# Altium schematic sheet STM32H743VIT6.SchDoc
size A4; SheetNumber: 1; SheetTotal: 2
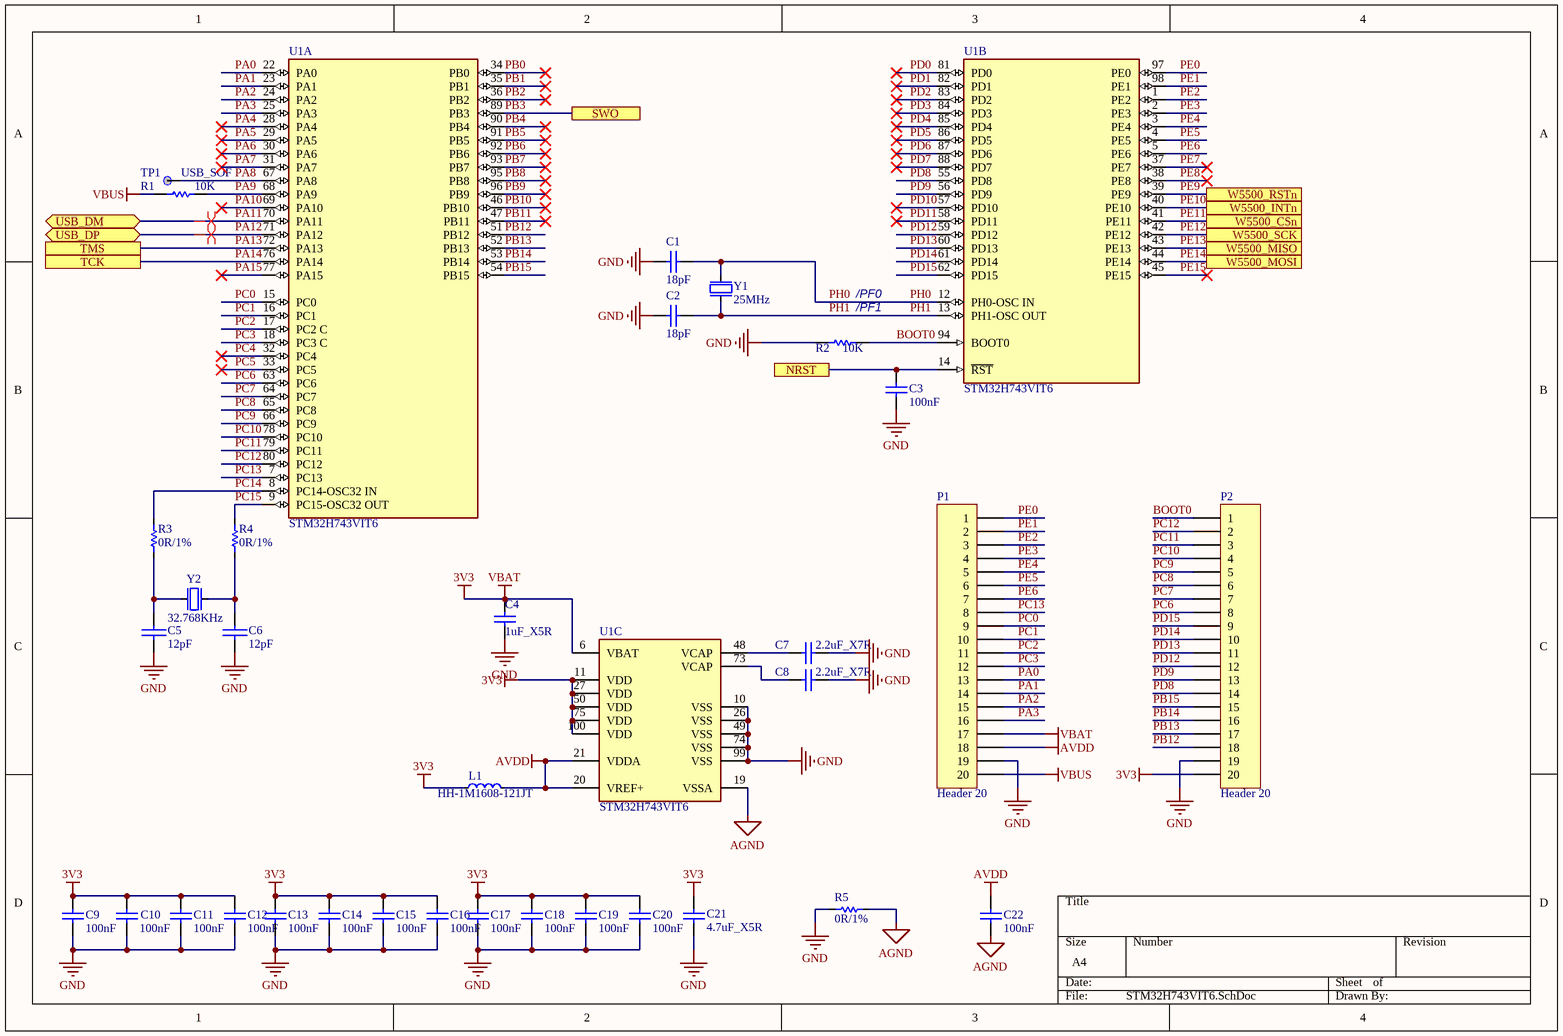
[diagram p0: STM32H743VIT6.SchDoc]

## Parts
C1  18pF  [CAP-0402]
C2  18pF  [CAP-0402]
C3  100nF  [CAP-0402]
C4  1uF_X5R  [CAP-0402]
C5  12pF  [CAP-0402]
C6  12pF  [CAP-0402]
C7  2.2uF_X7R  [CAP-0402]
C8  2.2uF_X7R  [CAP-0402]
C9  100nF  [CAP-0402]
C10  100nF  [CAP-0402]
C11  100nF  [CAP-0402]
C12  100nF  [CAP-0402]
C13  100nF  [CAP-0402]
C14  100nF  [CAP-0402]
C15  100nF  [CAP-0402]
C16  100nF  [CAP-0402]
C17  100nF  [CAP-0402]
C18  100nF  [CAP-0402]
C19  100nF  [CAP-0402]
C20  100nF  [CAP-0402]
C21  4.7uF_X5R  [CAP-0402]
C22  100nF  [CAP-0402]
L1  HH-1M1608-121JT  [IND-0603]
P1  Header 20  [IDC-1X20]
P2  Header 20  [IDC-1X20]
R1  10K  [RES-0402]
R2  10K  [RES-0402]
R3  0R/1%  [RES-0402]
R4  0R/1%  [RES-0402]
R5  0R/1%  [RES-0402]
TP1  USB_SOF  [TP]
U1  STM32H743VIT6  [FP-LQFP100-1L-MFG]  (parts A,B,C of 3)
Y1  25MHz  [OSC-S3225A]
Y2  32.768KHz  [OSC-S3225A]

## Ports
NRST, SWO, TCK, TMS, USB_DM (bidir), USB_DP (bidir), W5500_CSn, W5500_INTn, W5500_MISO, W5500_MOSI, W5500_RSTn, W5500_SCK

## Nets
3V3: C4.2 C9.1 C10.1 C11.1 C12.1 C13.1 C14.1 C15.1 C16.1 C17.1 C18.1 C19.1 C20.1 C21.1 L1.1 P1.17 P2.20 U1.6(VBAT) U1.11(VDD) U1.27(VDD) U1.50(VDD) U1.75(VDD) U1.100(VDD)  [also labelled VBAT]
AGND: C22.2 R5.1 U1.19(VSSA)
AVDD: C22.1 L1.2 P1.18 U1.20(VREF+) U1.21(VDDA)
GND: C1.1 C2.1 C3.2 C4.1 C5.2 C6.2 C7.2 C8.2 C9.2 C10.2 C11.2 C12.2 C13.2 C14.2 C15.2 C16.2 C17.2 C18.2 C19.2 C20.2 C21.2 P1.19 P2.19 R2.1 R5.2 U1.10(VSS) U1.26(VSS) U1.49(VSS) U1.74(VSS) U1.99(VSS) Y1.2(GND) Y1.4(GND) Y2.2(GND) Y2.4(GND)
VBUS: P1.20 R1.1
BOOT0: P2.1 R2.2 U1.94(BOOT0)
NRST: C3.1 U1.14(~{RST}) ; port NRST
PA0: P1.13 U1.22(PA0)
PA1: P1.14 U1.23(PA1)
PA2: P1.15 U1.24(PA2)
PA3: P1.16 U1.25(PA3)
PA4: U1.28(PA4)
PA5: U1.29(PA5)
PA6: U1.30(PA6)
PA7: U1.31(PA7)
PA8: TP1.1 U1.67(PA8)
PA9: R1.2 U1.68(PA9)
PA10: U1.69(PA10)
PA11: U1.70(PA11) ; port USB_DM
PA12: U1.71(PA12) ; port USB_DP
PA13: U1.72(PA13) ; port TMS
PA14: U1.76(PA14) ; port TCK
PA15: U1.77(PA15)
PB0: U1.34(PB0)
PB1: U1.35(PB1)
PB2: U1.36(PB2)
PB3: U1.89(PB3) ; port SWO
PB4: U1.90(PB4)
PB5: U1.91(PB5)
PB6: U1.92(PB6)
PB7: U1.93(PB7)
PB8: U1.95(PB8)
PB9: U1.96(PB9)
PB10: U1.46(PB10)
PB11: U1.47(PB11)
PB12: P2.18 U1.51(PB12)
PB13: P2.17 U1.52(PB13)
PB14: P2.16 U1.53(PB14)
PB15: P2.15 U1.54(PB15)
PC0: P1.9 U1.15(PC0)
PC1: P1.10 U1.16(PC1)
PC2: P1.11 U1.17(PC2_C)
PC3: P1.12 U1.18(PC3_C)
PC4: U1.32(PC4)
PC5: U1.33(PC5)
PC6: P2.8 U1.63(PC6)
PC7: P2.7 U1.64(PC7)
PC8: P2.6 U1.65(PC8)
PC9: P2.5 U1.66(PC9)
PC10: P2.4 U1.78(PC10)
PC11: P2.3 U1.79(PC11)
PC12: P2.2 U1.80(PC12)
PC13: P1.8 U1.7(PC13)
PC14: R3.2 U1.8(PC14-OSC32_IN)
PC15: R4.2 U1.9(PC15-OSC32_OUT)
PD0: U1.81(PD0)
PD1: U1.82(PD1)
PD2: U1.83(PD2)
PD3: U1.84(PD3)
PD4: U1.85(PD4)
PD5: U1.86(PD5)
PD6: U1.87(PD6)
PD7: U1.88(PD7)
PD8: P2.14 U1.55(PD8)
PD9: P2.13 U1.56(PD9)
PD10: U1.57(PD10)
PD11: U1.58(PD11)
PD12: P2.12 U1.59(PD12)
PD13: P2.11 U1.60(PD13)
PD14: P2.10 U1.61(PD14)
PD15: P2.9 U1.62(PD15)
PE0: P1.1 U1.97(PE0)
PE1: P1.2 U1.98(PE1)
PE2: P1.3 U1.1(PE2)
PE3: P1.4 U1.2(PE3)
PE4: P1.5 U1.3(PE4)
PE5: P1.6 U1.4(PE5)
PE6: P1.7 U1.5(PE6)
PE7: U1.37(PE7)
PE8: U1.38(PE8)
PE9: U1.39(PE9) ; port W5500_RSTn
PE10: U1.40(PE10) ; port W5500_INTn
PE11: U1.41(PE11) ; port W5500_CSn
PE12: U1.42(PE12) ; port W5500_SCK
PE13: U1.43(PE13) ; port W5500_MISO
PE14: U1.44(PE14) ; port W5500_MOSI
PE15: U1.45(PE15)
PH0: C1.2 U1.12(PH0-OSC_IN) Y1.1(inp)
PH1: C2.2 U1.13(PH1-OSC_OUT) Y1.3(out)
NetC5_1: C5.1 R3.1 Y2.1(inp)
NetC6_1: C6.1 R4.1 Y2.3(out)
NetC7_1: C7.1 U1.48(VCAP)
NetC8_1: C8.1 U1.73(VCAP)

## Layout directives
differential pair: PA11, PA12

## Notes on the sheet
- (near R2) /PF0
- (near R2) /PF1

## Library data of the parts
C1 C2 C4 = CAP-0402: Ceramic CAP 0402(1005)
C3 C9-C20 C22 = Cap: 0402; Value: 10nF; Published: 8-Jun-2000; Revision: July-2002: Re-released for DXP Platform.; Publisher: Altium Limited
C5 C6 = CAP: 0402
C7 C8 = Cap_2.2uF_X7R_10%_0805: 0402 X5R; Manuf_Part_1: CC0805KKX7R7BB225; Manuf_1: YAGEO; Value: 2.2uF; Revision: July-2002: Re-released for DXP Platform.; Order: CC0805KKX7R7BB225
C21 = CAP SMD 0603  X5R 1킚 25V 10%: 0402  X5R 4.7uF; Value: 1킚; Rated voltage: 25V; Tolerance: 10%; Manufacturer: *; Manufacturer P/N: *; Order code Farnell: 1288202RL; Power: *; Technology: X5R; Temperature  Factor: *; Temperature Max: +125캜; Temperature Min: -55캜; STS Code: *
L1 = IND-0603: Inductor 0603(1608)
P1 P2 = Header 20: Header, 20-Pin; LatestRevisionDate: 17-Jul-2002; LatestRevisionNote: Re-released for DXP Platform.; Publisher: Altium Limited
R1 = Resistor_ST: 0402; Value: 10K
R2 = res1: Resistor; Value: 1K; Published: 8-Jun-2000; Revision: July-2002: Re-released for DXP Platform.; Publisher: Altium Limited
R3-R5 = RES-0402
TP1 = TP
U1 = CMP-12105-000050-1: IC MCU 32BIT 2MB FLASH 100LQFP; Manufacturer: STMicroelectronics; Number Of Ethernet Channels: 1; Number Of Usb Channels: 2; Number Of A/D Converters: 3; Min Supply Voltage: 1.71V; Ram Size: 1060KBytes; Number Of I2C Channels: 4; Frequency: 480MHz; Number Of Adc Channels: 36; Number Of I/Os: 82; Max Supply Voltage: 3.6V; Number Of Spi Channels: 6; Memory Size: 2MBytes; Max Junction Temp: +125°C; Core Architecture: Arm Cortex-M7; Interface: I2C,SPI,UART,USART,USB,LIN,IrDA,Ethernet,I2S,Other; Number Of Timers/Counters: 20; Data Bus Width: 32bits; Number Of Pwm Channels: 42; Number Of Uart Channels: 9; Standoff Height: 0.05mm; Device Class L1: Integrated Circuits (ICs); ComponentLink2URL: https://www.st.com/resource/en/datasheet/stm32h743vi.pdf; Automotive: No; Memory Type: FLASH; Number Of Cores: 1; Temperature Range Low: -40°C; RoHS: TRUE; Ambient Temperature Range Low: -40°C; ComponentLink2Description: Datasheet; Device Class L2: Embedded Processors and Controllers; Device Class L3: Microcontrollers; Digikey Description: IC MCU 32BIT 2MB FLASH 100LQFP; Temperature Range High: +125°C; Ambient Temperature Range High: +85°C; Package: LQFP100-1L; Temperature: -40°C to +125°C; Category: IC; Ipc Land Pattern Name: QFP50P1600X1600X160-100; Height: 1.6mm; Manufacturer Part Number: STM32H743VIT6; Octopart: https://octopart.com/stm32h743vit6-stmicroelectronics-76372527; Lead Free: Yes
Y1 Y2 = OSC-82J0626-25MHz: X-tal 25MHz,3.2x2.5 SMD, CL=18pF